# Altium schematic sheet SY_HR08_MCU_SMT32_V1.1.SchDoc
size A3; PageSetup: Record=PageOptions|CenterHorizontal=True|CenterVertical=True|PrintScale=0.71|XCorrection=1.00|YCorrection=1.00|PrintKind=2|BorderSize=5000000|LeftOffset=0|BottomOffset=0|Orientation=2|PaperLength=1000|PaperWidth=1000|Scale=100|PaperSource=7|PrintQuality=-3|MediaType=1|DitherType=10|PrintScaleMode=1|PaperKind=A4|PaperIndex=9
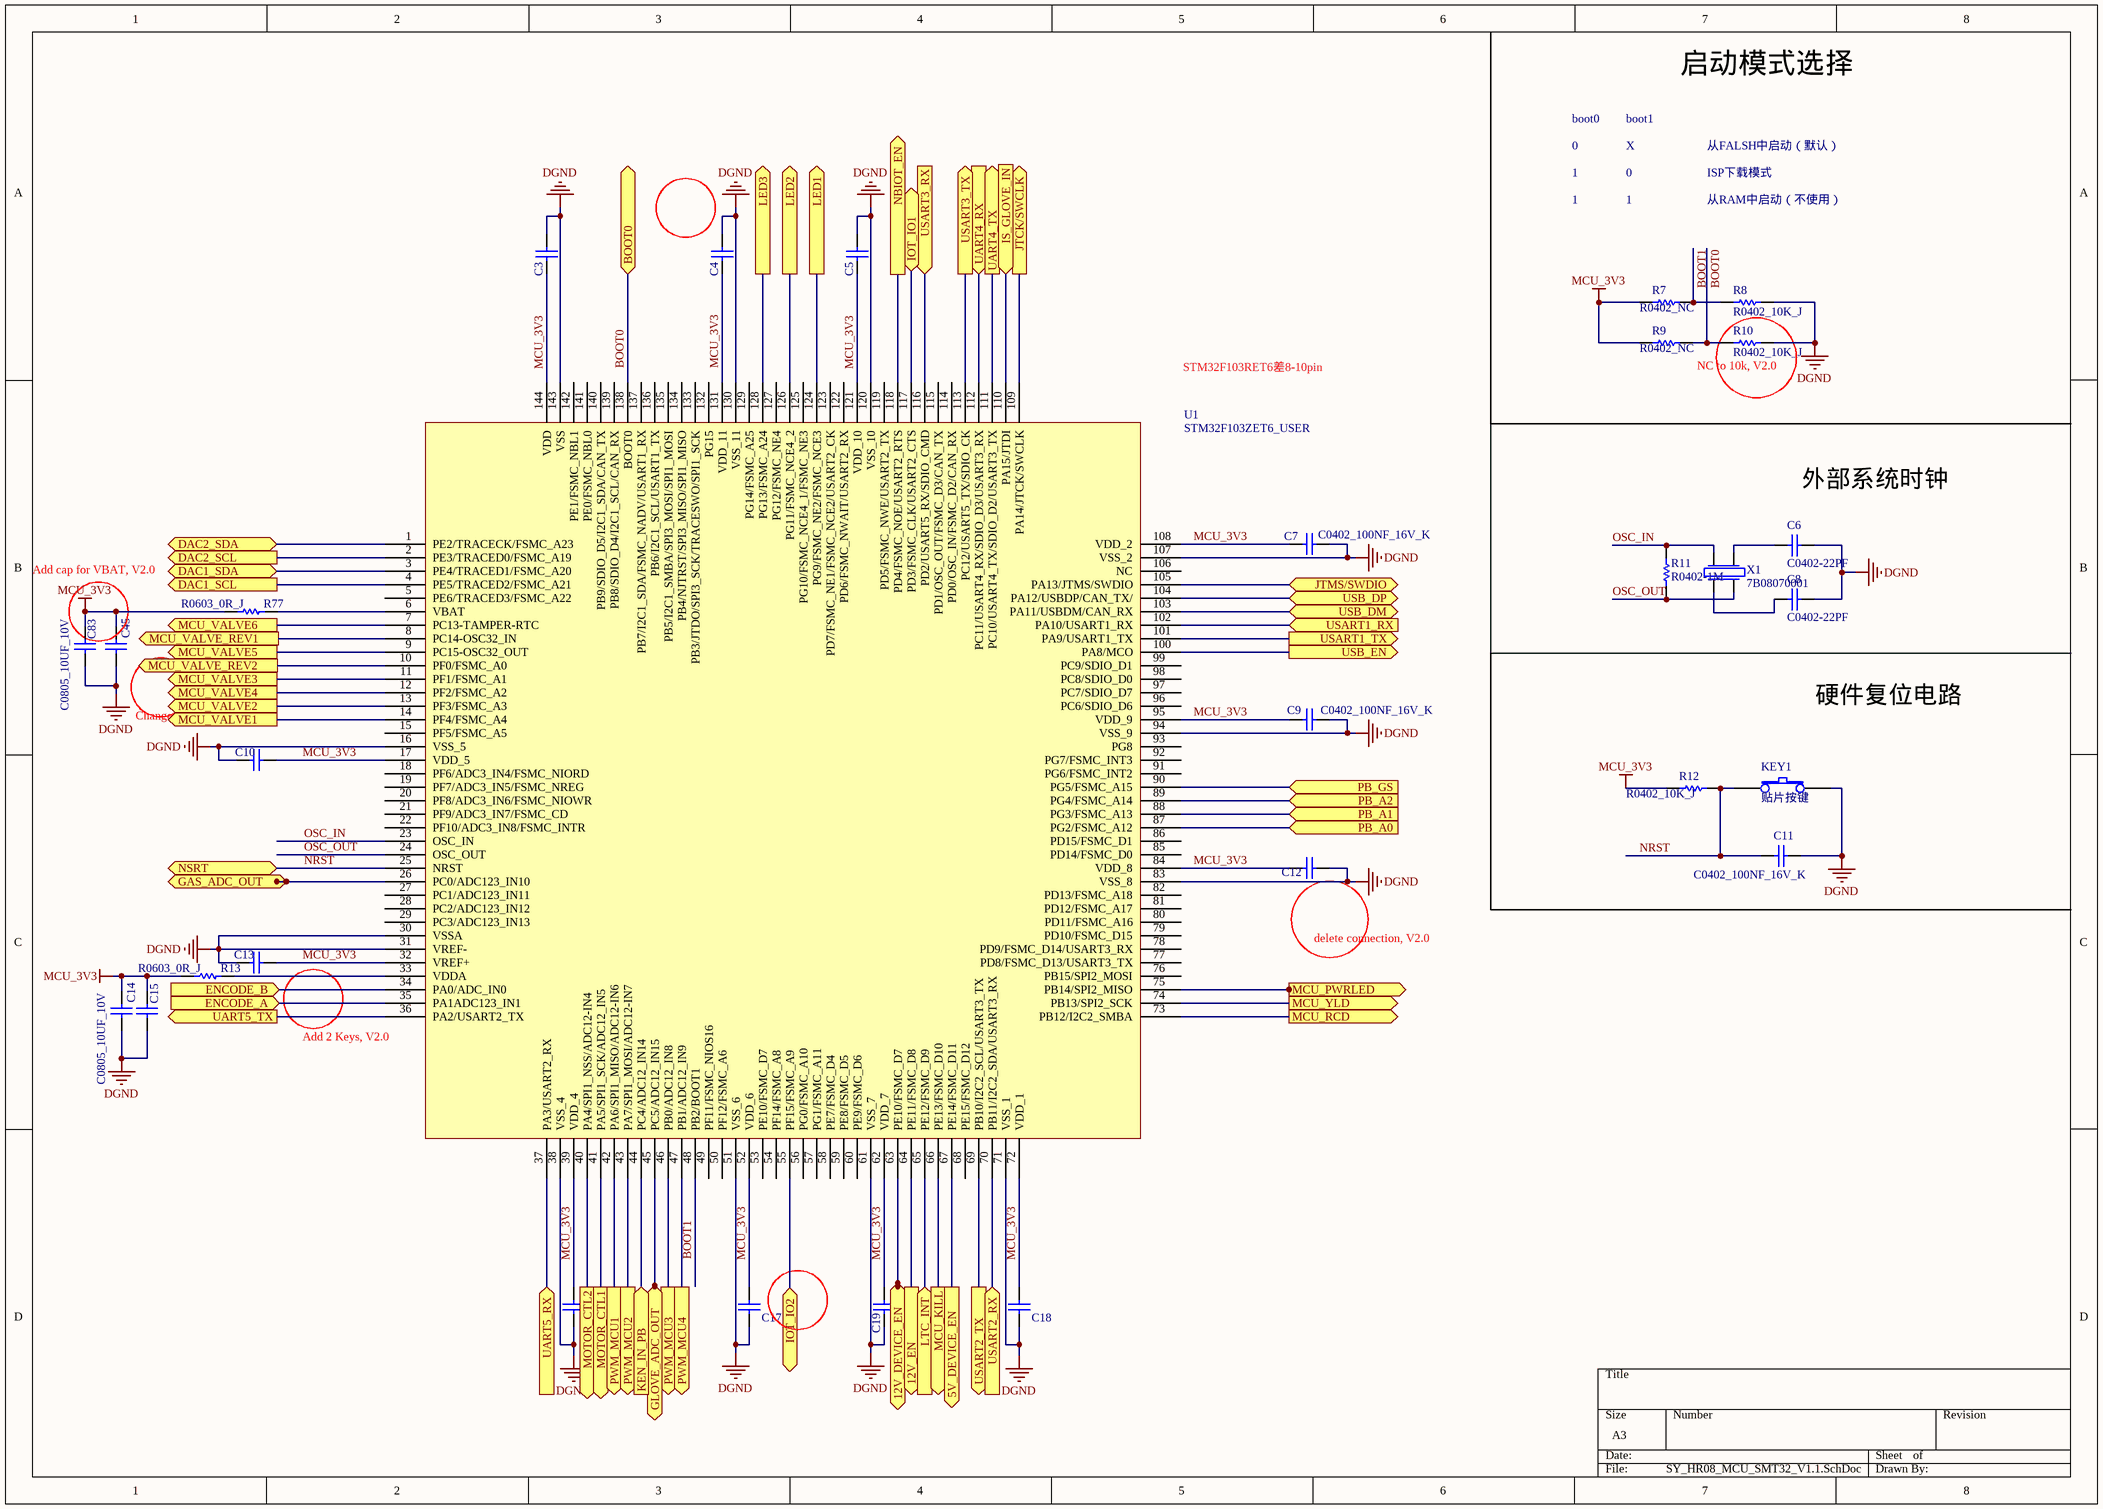
[diagram p0: SY_HR08_MCU_SMT32_V1.1.SchDoc]

## Parts
C3  C0402_100NF_16V_K  [CAP0402_HQ]  (value not drawn)
C4  C0402_100NF_16V_K  [CAP0402_HQ]  (value not drawn)
C5  C0402_100NF_16V_K  [CAP0402_HQ]  (value not drawn)
C6  C0402-22PF  [CAP0402_HQ]
C7  C0402_100NF_16V_K  [CAP0402_HQ]
C8  C0402-22PF  [CAP0402_HQ]
C9  C0402_100NF_16V_K  [CAP0402_HQ]
C10  C0402_100NF_16V_K  [CAP0402_HQ]  (value not drawn)
C11  C0402_100NF_16V_K  [CAP0402_HQ]
C12  C0402_100NF_16V_K  [CAP0402_HQ]  (value not drawn)
C13  C0402_100NF_16V_K  [CAP0402_HQ]  (value not drawn)
C14  C0805_10UF_10V  [CAP0805-B]
C15  C0402_100NF_16V_K  [CAP0402_HQ]  (value not drawn)
C16  C0402_100NF_16V_K  [CAP0402_HQ]  (value not drawn)
C17  C0402_100NF_16V_K  [CAP0402_HQ]  (value not drawn)
C18  C0402_100NF_16V_K  [CAP0402_HQ]  (value not drawn)
C19  C0402_100NF_16V_K  [CAP0402_HQ]  (value not drawn)
C45  C0805_10UF_10V  [CAP0805-B]
C83  C0402_100NF_16V_K  [CAP0402_HQ]  (value not drawn)
KEY1  贴片按键  [KEY_3x4x2]
R7  R0402_NC  [RES0402_HQ_NC]
R8  R0402_10K_J  [RES0402_HQ]
R9  R0402_NC  [RES0402_HQ_NC]
R10  R0402_10K_J  [RES0402_HQ_NC]
R11  R0402-1M  [RES0402_HQ]
R12  R0402_10K_J  [RES0402_HQ]
R13  R0603_0R_J  [RES0603-A]
R77  R0603_0R_J  [RES0603-A]
U1  STM32F103ZET6_USER  [LQFP144_STM32F103]
X1  7B08070001  [7B08070001]

## Ports
5V_DEVICE_EN (out), 12V_DEVICE_EN (out), 12V_EN (out), BOOT0 (bidir), DAC1_SCL (out), DAC1_SDA (bidir), DAC2_SCL (out), DAC2_SDA (bidir), ENCODE_A (in), ENCODE_B (in), GAS_ADC_OUT (in), GLOVE_ADC_OUT (in), IOT_IO1, IOT_IO2, IS_GLOVE_IN (in), JTCK/SWCLK (out), JTMS/SWDIO (bidir), KEN_IN_PB (in), LED1 (out), LED2 (out), LED3 (out), LTC_INT (in), MCU_KILL (out), MCU_PWRLED (out), MCU_RCD (out), MCU_VALVE1 (out), MCU_VALVE2 (out), MCU_VALVE3 (out), MCU_VALVE4 (out), MCU_VALVE5 (out), MCU_VALVE6 (out), MCU_VALVE_REV1 (out), MCU_VALVE_REV2 (out), MCU_YLD (out), MOTOR_CTL1 (out), MOTOR_CTL2 (out), NBIOT_EN (out), NSRT (bidir), PB_A0 (in), PB_A1 (in), PB_A2 (in), PB_GS (in), PWM_MCU1 (out), PWM_MCU2 (out), PWM_MCU3 (out), PWM_MCU4 (out), UART4_RX (in), UART4_TX (out), UART5_RX (in), UART5_TX (out), USART1_RX (in), USART1_TX (out), USART2_RX (in), USART2_TX (out), USART3_RX (in), USART3_TX (out), USB_DM (bidir), USB_DP (bidir), USB_EN (out)

## Nets
DGND: C3.2 C4.2 C5.2 C6.2 C7.2 C8.2 C9.2 C10.2 C11.2 C12.2 C13.2 C14.1 C15.2 C16.2 C17.2 C18.2 C19.2 C45.1 C83.2 KEY1.2 R8.2 R10.2 U1.16(VSS_5) U1.30(VSSA) U1.31(VREF-) U1.38(VSS_4) U1.51(VSS_6) U1.61(VSS_7) U1.71(VSS_1) U1.83(VSS_8) U1.94(VSS_9) U1.107(VSS_2) U1.120(VSS_10) U1.130(VSS_11) U1.143(VSS)
MCU_3V3: C3.1 C4.1 C5.1 C7.1 C9.1 C10.1 C12.1 C13.1 C14.2 C15.1 C16.1 C17.1 C18.1 C19.1 C45.2 C83.1 R7.1 R9.1 R12.1 R13.1 R77.1 U1.17(VDD_5) U1.32(VREF+) U1.39(VDD_4) U1.52(VDD_6) U1.62(VDD_7) U1.72(VDD_1) U1.84(VDD_8) U1.95(VDD_9) U1.108(VDD_2) U1.121(VDD_10) U1.131(VDD_11) U1.144(VDD)
5V_DEVICE_EN: U1.67(PE14/FSMC_D11) ; port 5V_DEVICE_EN
12V_DEVICE_EN: U1.63(PE10/FSMC_D7) ; port 12V_DEVICE_EN
12V_EN: U1.64(PE11/FSMC_D8) ; port 12V_EN
BOOT0: R9.2 R10.1 U1.138(BOOT0) ; port BOOT0
BOOT1: R7.2 R8.1 U1.48(PB2/BOOT1)
DAC1_SCL: U1.4(PE5/TRACED2/FSMC_A21) ; port DAC1_SCL
DAC1_SDA: U1.3(PE4/TRACED1/FSMC_A20) ; port DAC1_SDA
DAC2_SCL: U1.2(PE3/TRACED0/FSMC_A19) ; port DAC2_SCL
DAC2_SDA: U1.1(PE2/TRACECK/FSMC_A23) ; port DAC2_SDA
ENCODE_A: U1.35(PA1ADC123_IN1) ; port ENCODE_A
ENCODE_B: U1.34(PA0/ADC_IN0) ; port ENCODE_B
GAS_ADC_OUT: U1.26(PC0/ADC123_IN10) ; port GAS_ADC_OUT
GLOVE_ADC_OUT: U1.45(PC5/ADC12_IN15) ; port GLOVE_ADC_OUT
IOT_IO1: U1.117(PD3/FSMC_CLK/USART2_CTS) ; port IOT_IO1
IOT_IO2: U1.55(PF15/FSMC_A9) ; port IOT_IO2
IS_GLOVE_IN: U1.110(PA15/JTDI) ; port IS_GLOVE_IN
JTCK/SWCLK: U1.109(PA14/JTCK/SWCLK) ; port JTCK/SWCLK
JTMS/SWDIO: U1.105(PA13/JTMS/SWDIO) ; port JTMS/SWDIO
KEN_IN_PB: U1.44(PC4/ADC12_IN14) ; port KEN_IN_PB
LED1: U1.124(PG9/FSMC_NE2/FSMC_NCE3) ; port LED1
LED2: U1.126(PG11/FSMC_NCE4_2) ; port LED2
LED3: U1.128(PG13/FSMC_A24) ; port LED3
LTC_INT: U1.65(PE12/FSMC_D9) ; port LTC_INT
MCU_KILL: U1.66(PE13/FSMC_D10) ; port MCU_KILL
MCU_PWRLED: U1.75(PB14/SPI2_MISO) ; port MCU_PWRLED
MCU_RCD: U1.73(PB12/I2C2_SMBA) ; port MCU_RCD
MCU_VALVE1: U1.14(PF4/FSMC_A4) ; port MCU_VALVE1
MCU_VALVE2: U1.13(PF3/FSMC_A3) ; port MCU_VALVE2
MCU_VALVE3: U1.11(PF1/FSMC_A1) ; port MCU_VALVE3
MCU_VALVE4: U1.12(PF2/FSMC_A2) ; port MCU_VALVE4
MCU_VALVE5: U1.9(PC15-OSC32_OUT) ; port MCU_VALVE5
MCU_VALVE6: U1.7(PC13-TAMPER-RTC) ; port MCU_VALVE6
MCU_VALVE_REV1: U1.8(PC14-OSC32_IN) ; port MCU_VALVE_REV1
MCU_VALVE_REV2: U1.10(PF0/FSMC_A0) ; port MCU_VALVE_REV2
MCU_YLD: U1.74(PB13/SPI2_SCK) ; port MCU_YLD
MOTOR_CTL1: U1.41(PA5/SPI1_SCK/ADC12_IN5) ; port MOTOR_CTL1
MOTOR_CTL2: U1.40(PA4/SPI1_NSS/ADC12-IN4) ; port MOTOR_CTL2
NBIOT_EN: U1.118(PD4/FSMC_NOE/USART2_RTS) ; port NBIOT_EN
NRST: C11.1 KEY1.1 R12.2 U1.25(NRST) ; port NSRT
OSC_IN: R11.2 U1.23(OSC_IN) X1.3
OSC_OUT: R11.1 U1.24(OSC_OUT) X1.1
PB_A0: U1.87(PG2/FSMC_A12) ; port PB_A0
PB_A1: U1.88(PG3/FSMC_A13) ; port PB_A1
PB_A2: U1.89(PG4/FSMC_A14) ; port PB_A2
PB_GS: U1.90(PG5/FSMC_A15) ; port PB_GS
PWM_MCU1: U1.42(PA6/SPI1_MISO/ADC12-IN6) ; port PWM_MCU1
PWM_MCU2: U1.43(PA7/SPI1_MOSI/ADC12-IN7) ; port PWM_MCU2
PWM_MCU3: U1.46(PB0/ADC12_IN8) ; port PWM_MCU3
PWM_MCU4: U1.47(PB1/ADC12_IN9) ; port PWM_MCU4
UART4_RX: U1.112(PC11/USART4_RX/SDIO_D3/USART3_RX) ; port UART4_RX
UART4_TX: U1.111(PC10/USART4_TX/SDIO_D2/USART3_TX) ; port UART4_TX
UART5_RX: U1.37(PA3/USART2_RX) ; port UART5_RX
UART5_TX: U1.36(PA2/USART2_TX) ; port UART5_TX
USART1_RX: U1.102(PA10/USART1_RX) ; port USART1_RX
USART1_TX: U1.101(PA9/USART1_TX) ; port USART1_TX
USART2_RX: U1.70(PB11/I2C2_SDA/USART3_RX) ; port USART2_RX
USART2_TX: U1.69(PB10/I2C2_SCL/USART3_TX) ; port USART2_TX
USART3_RX: U1.116(PD2/USART5_RX/SDIO_CMD) ; port USART3_RX
USART3_TX: U1.113(PC12/USART5_TX/SDIO_CK) ; port USART3_TX
USB_DM: U1.103(PA11/USBDM/CAN_RX) ; port USB_DM
USB_DP: U1.104(PA12/USBDP/CAN_TX/) ; port USB_DP
USB_EN: U1.100(PA8/MCO) ; port USB_EN
NetC6_1: C6.1 X1.2
NetC8_1: C8.1 X1.4
NetR13_2: R13.2 U1.33(VDDA)
NetR77_2: R77.2 U1.6(VBAT)

Not connected (* = marked no-connect by the designer): U1 5(PE6/TRACED3/FSMC_A22) 15(PF5/FSMC_A5) 18(PF6/ADC3_IN4/FSMC_NIORD) 19(PF7/ADC3_IN5/FSMC_NREG) 20(PF8/ADC3_IN6/FSMC_NIOWR) 21(PF9/ADC3_IN7/FSMC_CD) 22(PF10/ADC3_IN8/FSMC_INTR) 27(PC1/ADC123_IN11) 28(PC2/ADC123_IN12) 29(PC3/ADC123_IN13) 49(PF11/FSMC_NIOS16) 50(PF12/FSMC_A6) 53(PE10/FSMC_D7) 54(PF14/FSMC_A8) 56(PG0/FSMC_A10) 57(PG1/FSMC_A11) 58(PE7/FSMC_D4) 59(PE8/FSMC_D5) 60(PE9/FSMC_D6) 68(PE15/FSMC_D12) 76(PB15/SPI2_MOSI) 77(PD8/FSMC_D13/USART3_TX) 78(PD9/FSMC_D14/USART3_RX) 79(PD10/FSMC_D15) 80(PD11/FSMC_A16) 81(PD12/FSMC_A17) 82(PD13/FSMC_A18) 85(PD14/FSMC_D0) 86(PD15/FSMC_D1) 91(PG6/FSMC_INT2) 92(PG7/FSMC_INT3) 93(PG8) 96(PC6/SDIO_D6) 97(PC7/SDIO_D7) 98(PC8/SDIO_D0) 99(PC9/SDIO_D1) 106(NC) 114(PD0/OSC_IN/FSMC_D2/CAN_RX) 115(PD1/OSC_OUT/FSMC_D3/CAN_TX) 119(PD5/FSMC_NWE/USART2_TX) 122(PD6/FSMC_NWAIT/USART2_RX) 123(PD7/FSMC_NE1/FSMC_NCE2/USART2_CK) 125(PG10/FSMC_NCE4_1/FSMC_NE3) 127(PG12/FSMC_NE4) 129(PG14/FSMC_A25) 132(PG15) 133(PB3/JTDO/SPI3_SCK/TRACESWO/SPI1_SCK) 134(PB4/NJTRST/SPI3_MISO/SPI1_MISO) 135(PB5/I2C1_SMBA/SPI3_MOSI/SPI1_MOSI) 136(PB6/I2C1_SCL/USART1_TX) 137(PB7/I2C1_SDA/FSMC_NADV/USART1_RX) 139(PB8/SDIO_D4/I2C1_SCL/CAN_RX) 140(PB9/SDIO_D5/I2C1_SDA/CAN_TX) 141(PE0/FSMC_NBL0) 142(PE1/FSMC_NBL1)

## Notes on the sheet
- 启动模式选择
- boot0
- 0
- 1
- boot1
- X
- 从FALSH中启动（默认）
- ISP下载模式
- 从RAM中启动（不使用）
- STM32F103RET6差8-10pin
- NC to 10k, V2.0
- 外部系统时钟
- Add cap for VBAT, V2.0
- Change GPIO, V2.0
- 硬件复位电路
- delete connection, V2.0
- (near U1) Add 2 Keys, V2.0

## Library data of the parts
C3-C5 C7 C9-C13 C15-C19 C83 = C0402_100NF_16V_K: 电容_100nF_0402_X7R_16V_K; Geometry.Height: 0.55mm; Value: 100NF
C6 C8 = C0402-22PF: 电容_22pF_0402_C0G_50V_J; Geometry.Height: 0.55mm; Value: 22pf
C14 C45 = C0805_10UF_10V: 电容_10uF_0805_X5R_10V_K
KEY1 = KEY_3x4x2: KEY_3x4x2mm
R7 R9 R10 = R0402_NC: NC; Part Number: NC; Value: NC
R8 R12 = R0402_10K_J: 电阻10K(0402-0.0625W-J)
R11 = R0402-1M: 电阻_1M(0402-0.0625W-J); Geometry.Height: 0.4mm; Value: 1M
R13 R77 = R0603_0R_J: 电阻0R(0603-0.1W-J)
X1 = 7B08070001: TXC 5032 7B系列晶体; Geometry.Height: 1.05mm; Value: 8M; Manufacturer: TXC